# EAGLE schematic DigitalBoard (EAGLE 7.2.0)
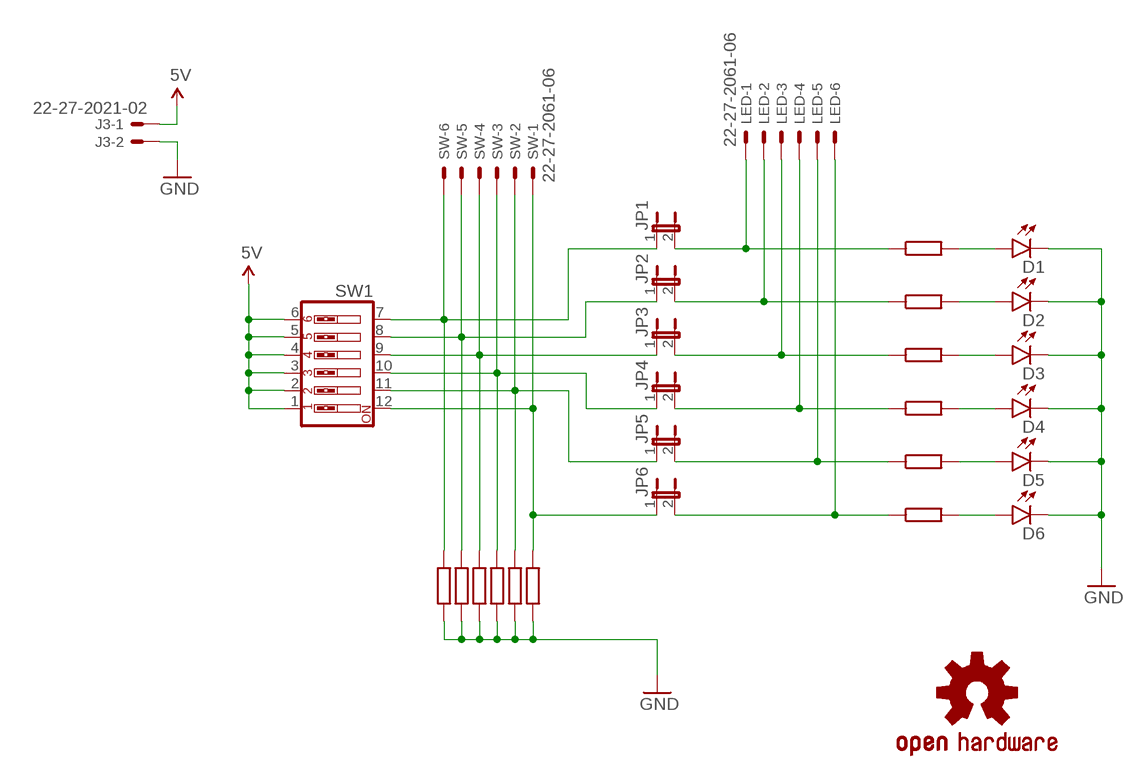
[diagram p0: schematic, sheet 1]

## Parts
D1  LED5MM  [LED5MM]
D2  LED5MM  [LED5MM]
D3  LED5MM  [LED5MM]
D4  LED5MM  [LED5MM]
D5  LED5MM  [LED5MM]
D6  LED5MM  [LED5MM]
J3  22-27-2021-02  [6410-02]
JP1  JP1E  [JP1]
JP2  JP1E  [JP1]
JP3  JP1E  [JP1]
JP4  JP1E  [JP1]
JP5  JP1E  [JP1]
JP6  JP1E  [JP1]
LED  22-27-2061-06  [6410-06]
LOGO1  OSHW-LOGOS-COPPER  [OSHW-LOGO-S_COPPER]
SW  22-27-2061-06  [6410-06]
SW1  SW_DIP-6  [EDG-06]

## Nets
5V: J3.1 SW1.1 SW1.2 SW1.3 SW1.4 SW1.5 SW1.6
GND: D1.K(C) D2.K(C) D3.K(C) D4.K(C) D5.K(C) D6.K(C) J3.2
N$1: JP1.1 SW1.7 SW.6
N$2: JP2.1 SW1.8 SW.5
N$3: JP3.1 SW1.9 SW.4
N$4: JP4.1 SW1.10 SW.3
N$5: JP5.1 SW1.11 SW.2
N$6: JP6.1 SW1.12 SW.1
N$7: JP1.2 LED.1
N$8: JP2.2 LED.2
N$9: JP3.2 LED.3
N$10: JP4.2 LED.4
N$11: JP5.2 LED.5
N$12: JP6.2 LED.6
N$13: D1.A
N$14: D2.A
N$15: D3.A
N$16: D4.A
N$17: D5.A
N$18: D6.A

## Library data of the parts
D1-D6 = SparkFun-LED:LED: LEDs Standard schematic elements and footprints for 5mm, 3mm, 1206, and 0603 sized LEDs. 5mm - Spark Fun Electronics SKU : COM-00529 (and others)
J3 = con-molex:22-?-02: CONNECTOR wire to board 2.54 mm (.1 inch) pitch header; OC_FARNELL: unknown; OC_NEWARK: unknown
JP1-JP6 = jumper:JP1E: JUMPER
LED SW = con-molex:22-?-06: CONNECTOR wire to board 2.54 mm (.1 inch) pitch header; OC_FARNELL: unknown; OC_NEWARK: unknown
LOGO1 = SparkFun-Aesthetics:OSHW-LOGO: Open Source Hardware Logo This logo indicates the piece of hardware it is found on incorporates a OSHW license and/or adheres to the definition of open source hardware found here: http://freedomdefined.org/OSHW
SW1 = special:SW_DIP-6: DIP SWITCH